# EAGLE design uln_0.02 (EAGLE 8.0.0)
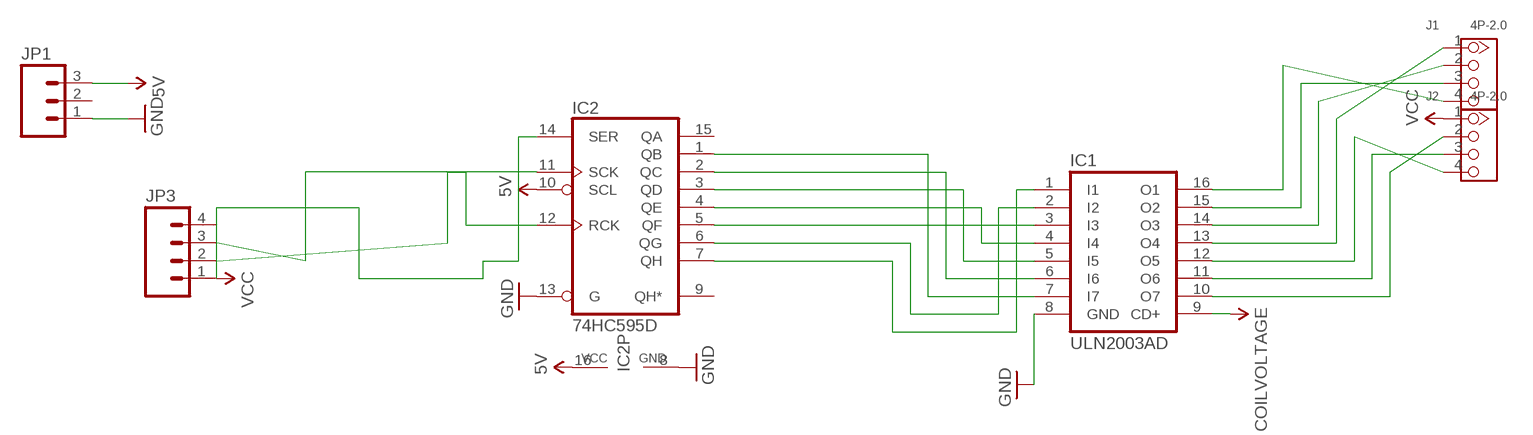
[diagram p0: schematic, sheet 1]

## Parts
IC1  ULN2003AD  [SO16]
IC2  74HC595D  [SO16]
J1  4P-2.0  GROVE-CONNECTOR-DIP(4P-2.0)  [HW4-2.0]
J2  4P-2.0  GROVE-CONNECTOR-DIP(4P-2.0)  [HW4-2.0]
JP1  M03PTH  [1X03]
JP3  M04PTH  [1X04]

## Nets
5V [DATA]: IC2.10(SCL) IC2.16(VCC) JP1.3
GND: IC1.8(GND) IC2.8(GND) IC2.13(G) JP1.1
N$1 [DATA]: IC1.7(I7) IC2.1(QB)
N$2 [DATA]: IC1.6(I6) IC2.2(QC)
N$3 [DATA]: IC1.5(I5) IC2.3(QD)
N$4 [DATA]: IC1.4(I4) IC2.4(QE)
N$5 [DATA]: IC1.3(I3) IC2.5(QF)
N$6 [DATA]: IC1.2(I2) IC2.6(QG)
N$7 [DATA]: IC1.1(I1) IC2.7(QH)
N$9: IC1.10(O7) J2.2
N$10: IC1.11(O6) J2.3
N$11: IC1.12(O5) J2.4
N$12: IC1.13(O4) J1.1
N$13: IC1.14(O3) J1.2
N$14: IC1.15(O2) J1.3
N$15: IC1.16(O1) J1.4
N$17 [DATA]: IC2.11(SCK) JP3.3
N$18 [DATA]: IC2.12(RCK) JP3.2
N$19 [DATA]: IC2.14(SER) JP3.1
VCC: IC1.9(CD+) J2.1 JP3.4 ; supply symbol labelled COILVOLTAGE
Unconnected: IC2.9(QH*) IC2.15(QA) JP1.2

## Library data of the parts
IC1 = uln-udn:ULN2003A: DRIVER ARRAY
IC2 = 74xx-eu:74*595: 8-bit SHIFT REGISTER, output latch
J1 J2 = Seeed-OPL-Connector:GROVE-CONNECTOR-DIP(4P-2.0): 320110033
JP1 = SparkFun:M03: Header 3 Standard 3-pin 0.1" header. Use with straight break away headers (SKU : PRT-00116), right angle break away headers (PRT-00553), swiss pins (PRT-00743), machine pins (PRT-00117), and female headers (PRT-00115). Molex polarized connector foot print use with SKU : PRT-08232 with associated crimp pins and housings.
JP3 = SparkFun:M04: Header 4 Standard 4-pin 0.1" header. Use with straight break away headers (SKU : PRT-00116), right angle break away headers (PRT-00553), swiss pins (PRT-00743), machine pins (PRT-00117), and female headers (PRT-00115). Molex polarized connector foot print use with SKU : PRT-08231 with associated crimp pins and housings.

## Net classes
0 POWER: width 0.305 mm, drill 0.025 mm, clearance 0.025 mm
1 DATA: width 0.203 mm, drill 0.025 mm, clearance 0.025 mm

## Board
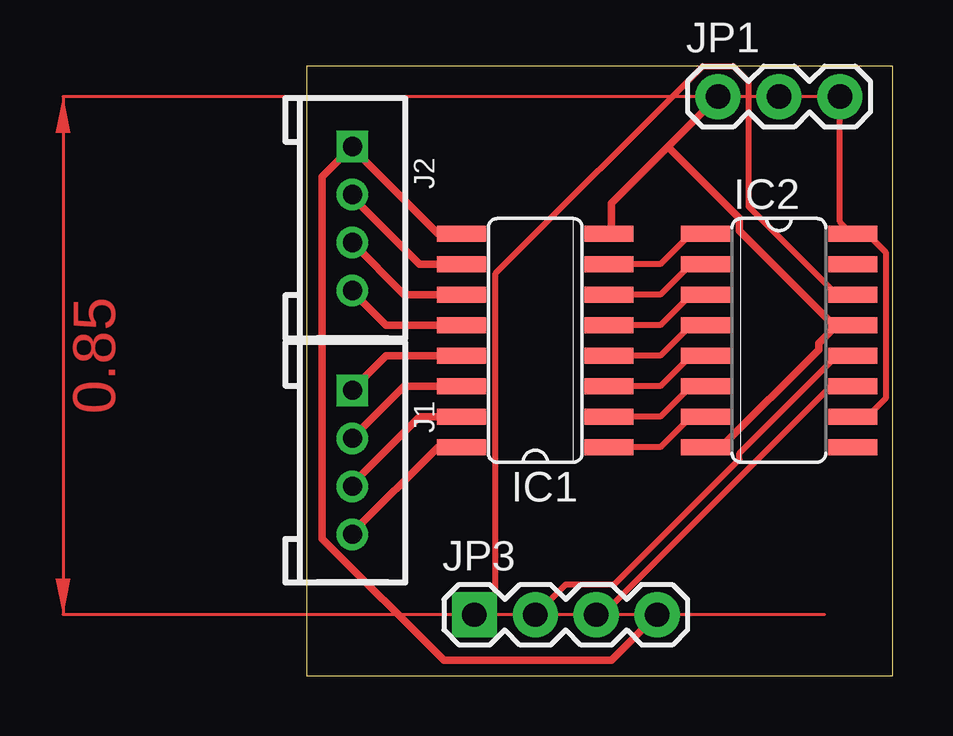
[diagram p1: board, top side]
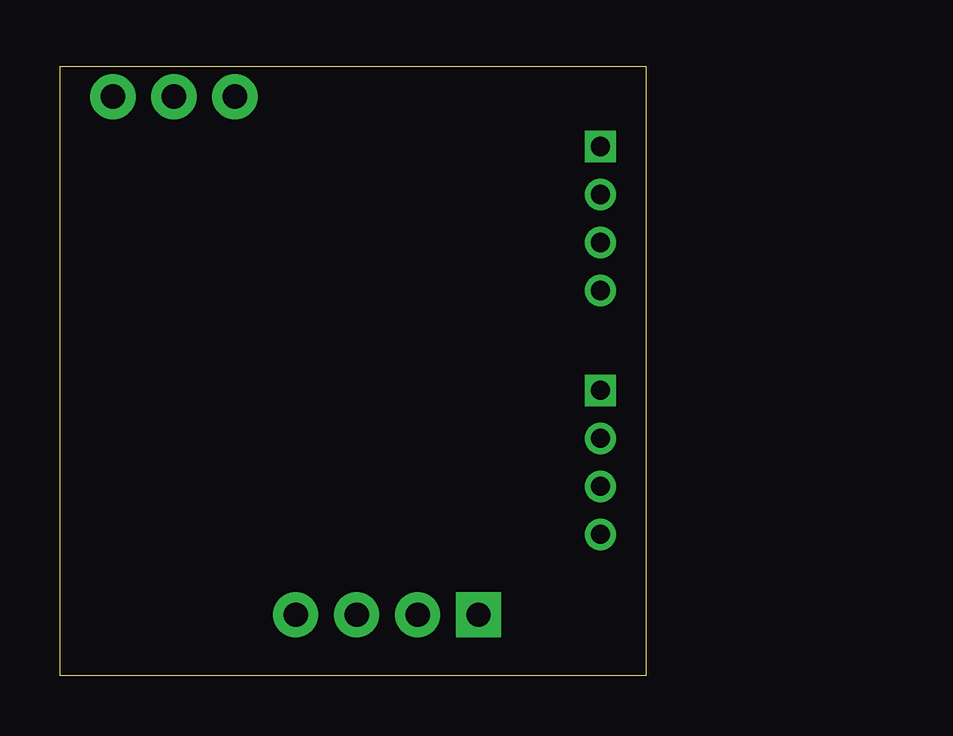
[diagram p2: board, bottom side, seen from below]

Size 24.43 x 25.39 mm. Coordinates in mm from the lower left corner, seen from the top.
Outline: 0,0 24.43,0 24.43,25.39 0,25.39 0,0
Copper layers (1*16): Top 0.035mm / dielectric 1.5mm / Bottom 0.035mm
Design rules "default": minimum track width 10mil, minimum drill 24mil, track to track 8mil, track to pad 8mil, pad to pad 8mil, via to via 8mil, smd to smd 8mil, copper to edge 40mil, drill to drill 8mil, minimum pad ring 10mil, minimum via ring 8mil, stop-mask expansion 4mil, vias tented up to drill 0mil, thermal gap 10mil

### Footprints (pad centres in the part's own frame; a part is rotated, then mirrored left to right if it is on the bottom)
SO16 = smd 0.66 x 2.032: 1 -4.445,-3.073; 2 -3.175,-3.073; 3 -1.905,-3.073; 4 -0.635,-3.073; 5 0.635,-3.073; 6 1.905,-3.073; 7 3.175,-3.073; 8 4.445,-3.073; 9 4.445,3.073; 10 3.175,3.073; 11 1.905,3.073; 12 0.635,3.073; 13 -0.635,3.073; 14 -1.905,3.073; 15 -3.175,3.073; 16 -4.445,3.073
HW4-2.0 = drill 0.8 pad 1.27 square: 1 -3,0 | drill 0.8 pad 1.27: 2 -1,0; 3 1,0; 4 3,0
1X03 = drill 1.016 pad 1.88: 1 0,0; 2 2.54,0; 3 5.08,0
1X04 = drill 1.016 pad 1.88 square: 1 0,0 | drill 1.016 pad 1.88: 2 2.54,0; 3 5.08,0; 4 7.62,0

### Placement (x,y rotation side)
IC1  9.53,13.97 90 top
IC2  19.68,13.97 270 top
J1  1.91,8.89 270 top
J2  1.91,19.05 270 top
JP1  17.14,24.13 0 top
JP3  6.99,2.54 0 top

### Tracks (layer width: path | path; a pad name or v marks a point on that pad's centre or on a via)
5V
  Top 0.254: IC2.10 23.37,10.79 24.13,11.56 24.13,17.65 23.37,18.41 IC2.16 22.73,18.41 22.23,18.92 JP1.3
GND
  Top 0.305: IC2.8 17.27,9.53 21.34,13.59 21.34,13.84 22.1,14.61 IC2.13 21.97,14.61 18.03,18.54 18.03,19.05 15.05,22.04 | JP1.1 15.05,22.04 | 15.05,22.04 12.7,19.68 12.7,18.41 IC1.8
N$1
  Top 0.254: IC1.7 14.73,17.14 16,18.41 IC2.1
N$2
  Top 0.254: IC1.6 14.73,15.88 16,17.14 IC2.2
N$3
  Top 0.254: IC1.5 14.73,14.61 16,15.88 IC2.3
N$4
  Top 0.254: IC1.4 14.73,13.34 16,14.61 IC2.4
N$5
  Top 0.254: IC1.3 14.73,12.06 16,13.34 IC2.5
N$6
  Top 0.254: IC1.2 14.73,10.79 16,12.06 IC2.6
N$7
  Top 0.254: IC1.1 14.73,9.53 16,10.79 IC2.7
N$9
  Top 0.305: IC1.10 4.7,17.14 1.91,19.94 J2.2
N$10
  Top 0.305: IC1.11 4.06,15.88 1.91,18.03 J2.3
N$11
  Top 0.305: IC1.12 3.3,14.61 1.91,16 J2.4
N$12
  Top 0.305: IC1.13 3.3,13.34 1.91,11.94 J1.1
N$13
  Top 0.305: IC1.14 4.06,12.06 1.91,9.91 J1.2
N$14
  Top 0.305: IC1.15 4.7,10.79 1.91,8 J1.3
N$15
  Top 0.305: IC1.16 5.46,9.53 1.91,5.97 J1.4
N$17
  Top 0.254: IC2.11 21.84,12.06 12.32,2.54 JP3.3
N$18
  Top 0.254: IC2.12 22.1,13.34 18.03,9.27 18.03,9.02 12.83,3.81 10.79,3.81 JP3.2
N$19
  Top 0.254: IC2.14 22.1,15.88 18.41,19.56 18.41,24.77 17.78,25.4 16.51,25.4 7.87,16.76 7.87,3.43 JP3.1
VCC
  Top 0.305: IC1.9 5.46,18.41 1.91,21.97 J2.1 0.64,20.78 0.64,5.71 5.71,0.64 12.7,0.64 JP3.4
  Bottom 0.305: 1.91,21.97 J2.1
(copper drawn outside any net)
  shapes: Top area x1